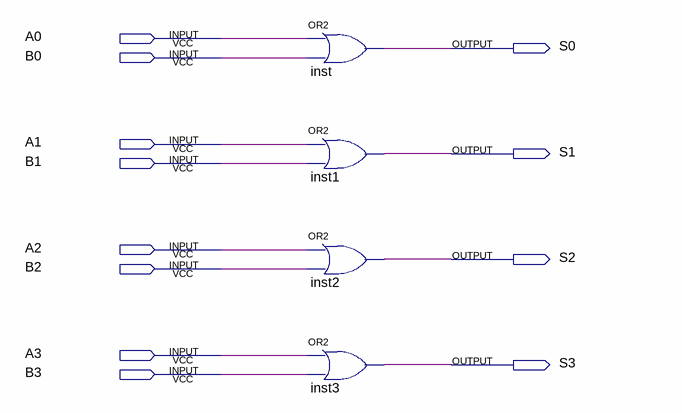
[diagram p0: schematic sheet]
// Quartus schematic OR.bdf as structural Verilog: 4 symbols, 12 pins
module OR (
  input  A0,
  input  B0,
  input  A1,
  input  B1,
  input  A2,
  input  B2,
  input  A3,
  input  B3,
  output S0,
  output S1,
  output S2,
  output S3
);

  or inst (S0, A0, B0);
  or inst1 (S1, A1, B1);
  or inst2 (S2, A2, B2);
  or inst3 (S3, A3, B3);
endmodule
